# Altium project B100BA.PrjPcb (part 1 of 6)
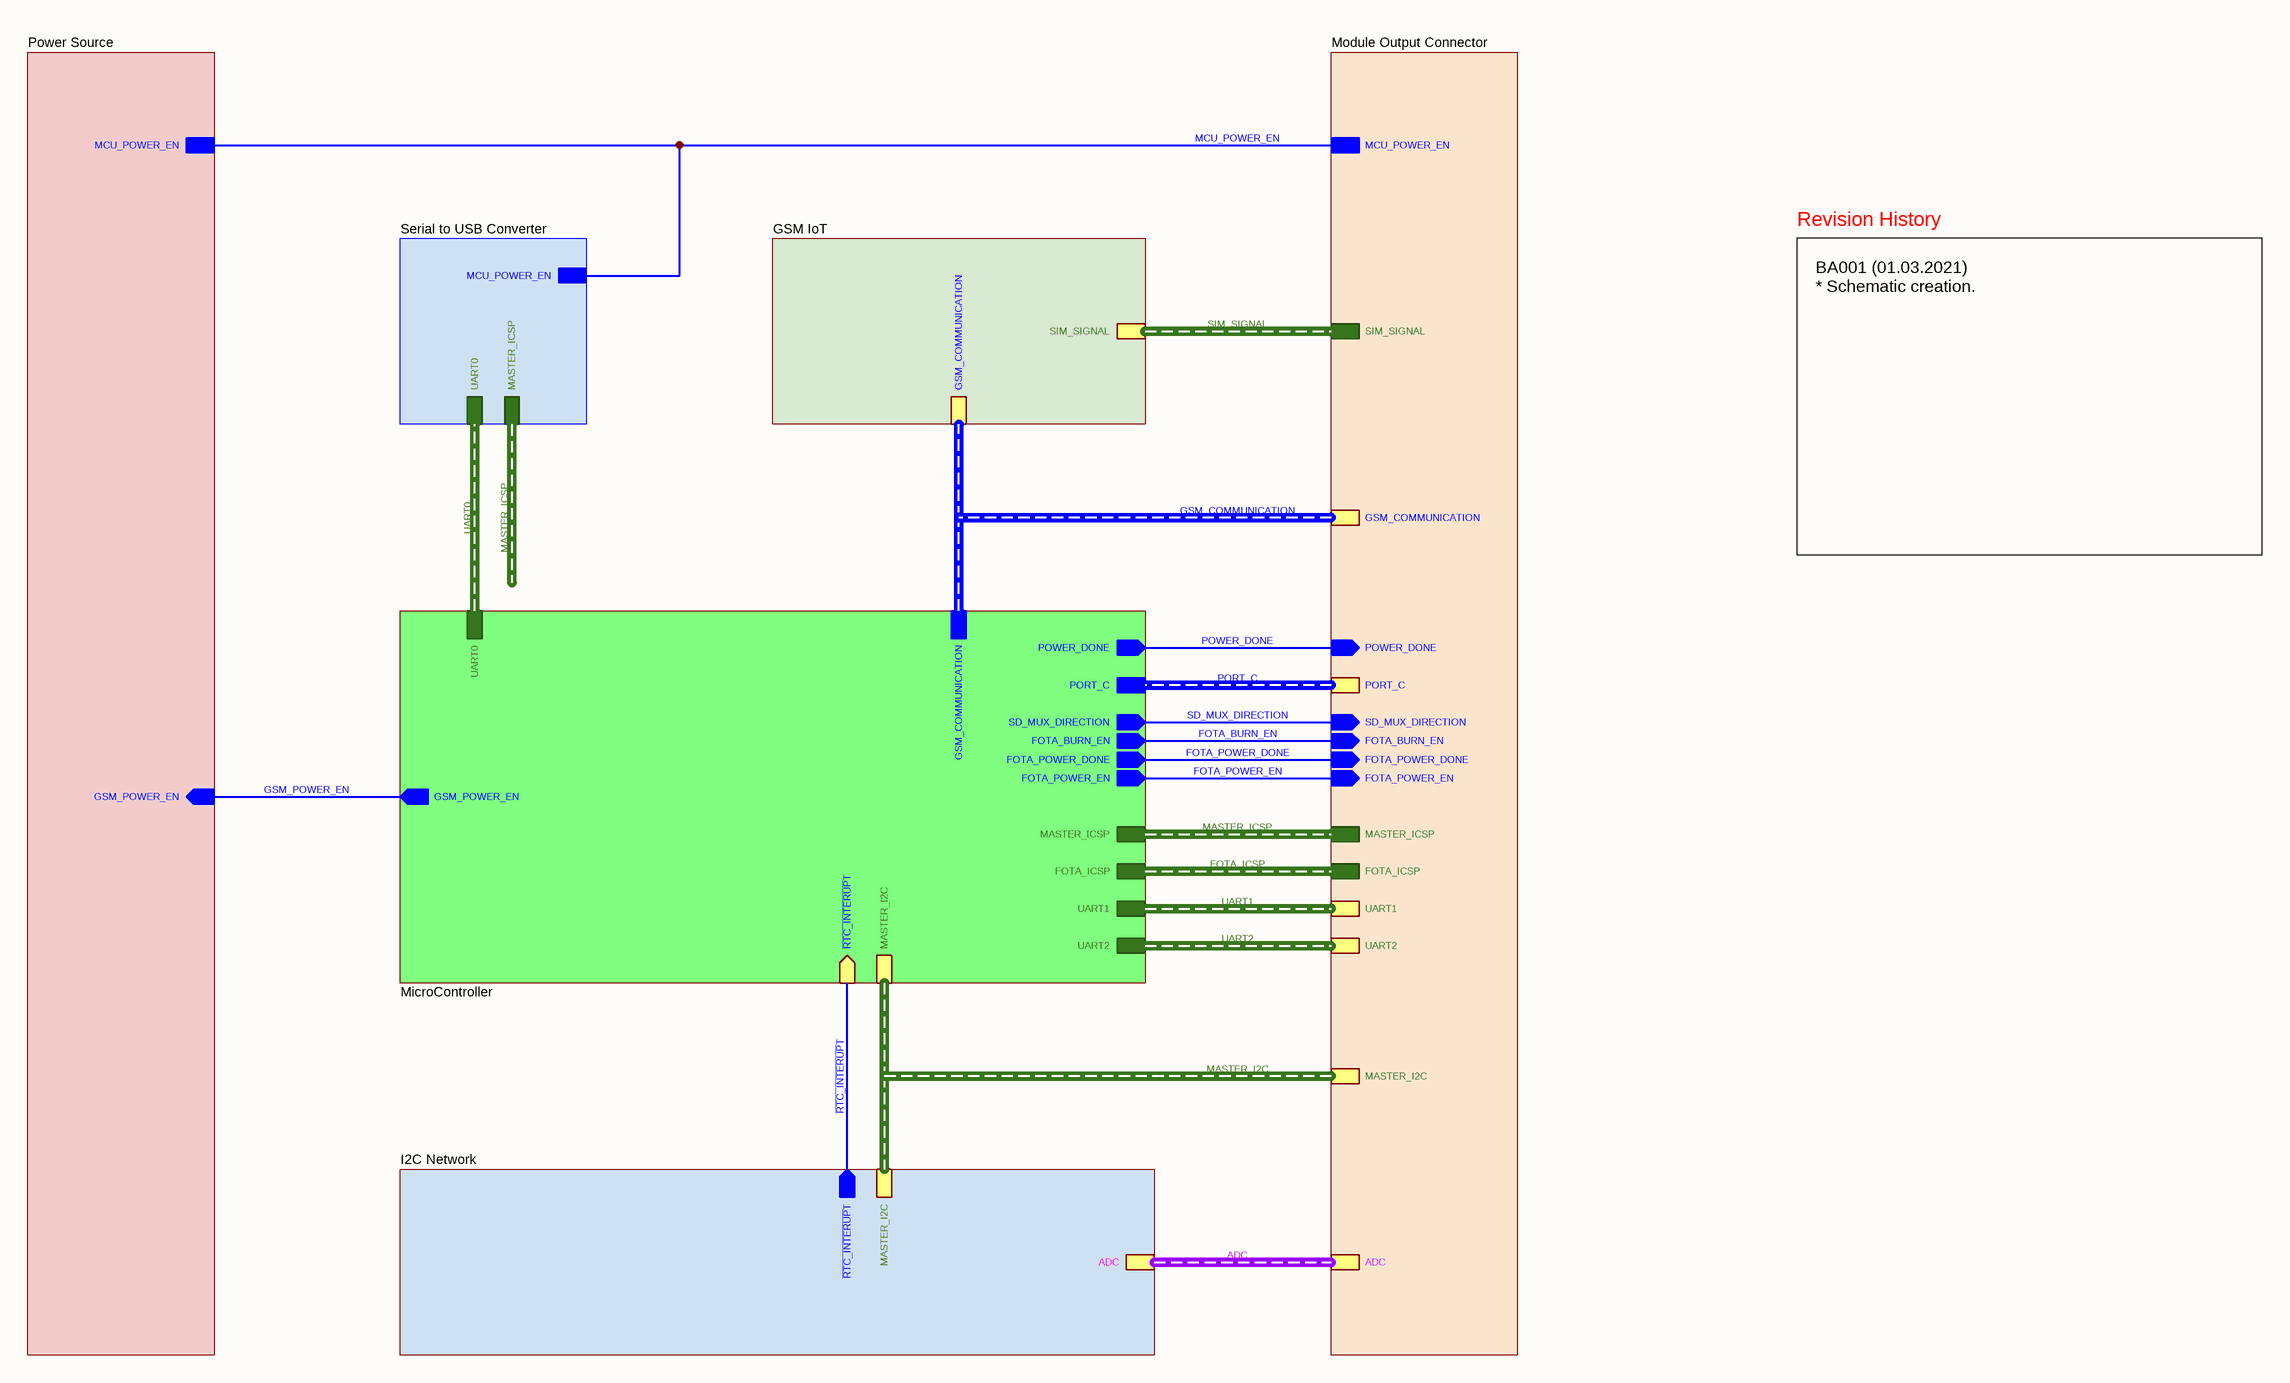
[diagram p0: B100 Block Diagram.SchDoc]
Address1_: Necip Fazıl Mah. Ortaırmak Sok.; Address2_: Birgül Apt. No: 19/6; Address3_: Meram / Konya; Address4_: Turkiye; Copyright_: © 2021 All rights reserved. [Commercial Secret]; Customer_: Ovoo Electronics; Engineer_: M. Günce Akkoyun; Git_Repo_Address_: https://www.github.com/akkoyun/B100; link_: http://www.ovoo.me; Module_ID_: B100; Organization_: Ovoo Electronics; Phone_: +90 506 7444300; Product_Desc_: GSM Iot Based Plug&Play SOM; Product_ID_: B100BA; Revision_: R01; Version_: BA
44 sheets, 277 parts. Net scope: hierarchical (ports join the sheet entries above them; power ports are global).
Sheets:
  B100 Block Diagram.SchDoc
    Power Source = Power Source.SchDoc
      3V8 Buck Boost Converter = 3V8 Buck Boost Converter.SchDoc
      5V Buck Boost Converter = 5V Buck Boost Converter.SchDoc
      Main Power Switch = Main Power Switch.SchDoc
      3V3 LDO Regulator = 3V3 LDO Regulator.SchDoc
    GSM IoT = GSM IoT Block Diagram.SchDoc
      GSM IoT Modem Core = GSM Modem Core.SchDoc
      GSM IoT eSIM = GSM eSIM.SchDoc
      GSM IoT Antenna = GSM Modem Antenna.SchDoc
      GSM IoT On/Off Control = GSM On-Off Control.SchDoc
      GSM IoT SDown Control = GSM SDown Control.SchDoc
      GSM Communication Voltage Translator = Bidirectional Voltage Translator.SchDoc
      GSM IoT LED Inducators = GSM LED Driver.SchDoc
    MicroController = MicroController.SchDoc
      Master MicroController = Master MicroController.SchDoc
        PORT L = Master MicroController Port L.SchDoc
        PORT K = Master MicroController Port K.SchDoc
        PORT F = Master MicroController Port F.SchDoc
        PORT D = Master MicroController Port D.SchDoc
        PORT C = Master MicroController Port C.SchDoc
        PORT B = Master MicroController Port B.SchDoc
        PORT A = Master MicroController Port A.SchDoc
        Master MicroController Core = Master MicroController Core.SchDoc
        PORT E = Master MicroController Port E.SchDoc
        PORT G = Master MicroController Port G.SchDoc
        PORT H = Master MicroController Port H.SchDoc
        PORT J = Master MicroController Port J.SchDoc
      SD Card and Select Switch = SD Card.SchDoc
      Piezzo Buzzer & Audio Amplifier = Buzzer.SchDoc
      LED Inducators = Master MicroController LED.SchDoc
      FOTA MicroController = FOTA MicroController Block Diagram.SchDoc
        FOTA MicroController Core = FOTA MicroController Core.SchDoc
        FOTA LED Driver = FOTA LED Driver.SchDoc
      FOTA Power Switch = FOTA MicroController Power Switch.SchDoc
      FOTA Burn Buffer = FOTA Burn Buffer.SchDoc
    I2C Network = I2C Network.SchDoc
      I2C Multiplexer = I2C Multiplexer.SchDoc
      I2C Real Time Clock = Real Time Clock.SchDoc
      I2C Serial ID EEprom = Serial ID EEPROM.SchDoc
      I2C EEprom = EEPROM.SchDoc
      I2C Analog Digital Converter = Analog Digital Converter.SchDoc
    Module Output Connector = Module Output Connector.SchDoc
    Serial to USB Converter = Serial to USB Converter.SchDoc

## Sheet B100 Block Diagram.SchDoc: B100 Block Diagram
size 393 x 281 mm; ApprovedBy: M. Günce Akkoyun; CheckedBy: M. Günce Akkoyun; Author: M. Günce Akkoyun; CompanyName: Ovoo Electronics; DrawnBy: M. Günce Akkoyun; Engineer: M. Günce Akkoyun; Organization: Ovoo Electronics; Address1: Necip Fazıl Mah. Ortaırmak Sok.; Address2: Birgül Apt. No: 19/6; Address3: Meram / Konya; Address4: Turkiye; DocumentNumber: 1; Revision: R01; SheetNumber: 1; SheetTotal: 44

### Sub-sheets
GSM IoT = GSM IoT Block Diagram.SchDoc: SIM_SIGNAL (harness SIM_SIGNAL), GSM_COMMUNICATION (harness GSM_COMMUNICATION)
I2C Network = I2C Network.SchDoc: MASTER_I2C (harness MASTER_I2C), ~{RTC_INTERUP}T (out), ADC (harness ADC)
MicroController = MicroController.SchDoc: MASTER_I2C (harness MASTER_I2C), ~{RTC_INTERUP}T (in), UART1 (harness UART1), UART2 (harness UART2), POWER_DONE (out), GSM_COMMUNICATION (harness GSM_COMMUNICATION), PORT_C (harness PORT_C), GSM_POWER_EN (out), UART0 (harness UART0), MASTER_ICSP (harness MASTER_ICSP), FOTA_ICSP (harness FOTA_ICSP), SD_MUX_DIRECTION (out), FOTA_BURN_EN (out), FOTA_POWER_DONE (out), FOTA_POWER_EN (out)
Module Output Connector = Module Output Connector.SchDoc: FOTA_ICSP (harness FOTA_ICSP), SIM_SIGNAL (harness SIM_SIGNAL), UART2 (harness UART2), GSM_COMMUNICATION (harness GSM_COMMUNICATION), ADC (harness ADC), MASTER_ICSP (harness MASTER_ICSP), MASTER_I2C (harness MASTER_I2C), UART1 (harness UART1), MCU_POWER_EN, PORT_C (harness PORT_C), POWER_DONE (in), SD_MUX_DIRECTION (in), FOTA_BURN_EN (in), FOTA_POWER_EN (in), FOTA_POWER_DONE (in)
Power Source = Power Source.SchDoc: GSM_POWER_EN (in), MCU_POWER_EN
Serial to USB Converter = Serial to USB Converter.SchDoc: UART0 (harness UART0), MASTER_ICSP (harness MASTER_ICSP), MCU_POWER_EN

### Nets
~{RTC_INTERUP}T: sheet MicroController/~{RTC_INTERUP}T, sheet I2C Network/~{RTC_INTERUP}T
FOTA_BURN_EN: sheet MicroController/FOTA_BURN_EN, sheet Module Output Connector/FOTA_BURN_EN
FOTA_POWER_DONE: sheet MicroController/FOTA_POWER_DONE, sheet Module Output Connector/FOTA_POWER_DONE
FOTA_POWER_EN: sheet MicroController/FOTA_POWER_EN, sheet Module Output Connector/FOTA_POWER_EN
GSM_POWER_EN: sheet Power Source/GSM_POWER_EN, sheet MicroController/GSM_POWER_EN
MCU_POWER_EN: sheet Power Source/MCU_POWER_EN, sheet Module Output Connector/MCU_POWER_EN, sheet Serial to USB Converter/MCU_POWER_EN
POWER_DONE: sheet MicroController/POWER_DONE, sheet Module Output Connector/POWER_DONE
SD_MUX_DIRECTION: sheet MicroController/SD_MUX_DIRECTION, sheet Module Output Connector/SD_MUX_DIRECTION

### Buses and harness runs
harness ADC = sheet I2C Network/ADC = sheet Module Output Connector/ADC
harness FOTA_ICSP = sheet MicroController/FOTA_ICSP = sheet Module Output Connector/FOTA_ICSP
harness GSM_COMMUNICATION = sheet GSM IoT/GSM_COMMUNICATION = sheet MicroController/GSM_COMMUNICATION = sheet Module Output Connector/GSM_COMMUNICATION
harness MASTER_I2C = sheet I2C Network/MASTER_I2C = sheet MicroController/MASTER_I2C = sheet Module Output Connector/MASTER_I2C
harness MASTER_ICSP = sheet MicroController/MASTER_ICSP = sheet Module Output Connector/MASTER_ICSP
harness MASTER_ICSP = sheet Serial to USB Converter/MASTER_ICSP
harness PORT_C = sheet MicroController/PORT_C = sheet Module Output Connector/PORT_C
harness SIM_SIGNAL = sheet GSM IoT/SIM_SIGNAL = sheet Module Output Connector/SIM_SIGNAL
harness UART0 = sheet MicroController/UART0 = sheet Serial to USB Converter/UART0
harness UART1 = sheet MicroController/UART1 = sheet Module Output Connector/UART1
harness UART2 = sheet MicroController/UART2 = sheet Module Output Connector/UART2

### Notes on the sheet
- Revision History
- BA001 (01.03.2021)
  * Schematic creation.
- © 2021 All rights reserved.
  This document may not, in whole or in part, be copied, photocopied, reproduced, translated or converted to any electronic or machine readable from without prior written permission of Mehmet Günce Akkoyun.
  Engineer contact : akkoyun@me.com
- Property of
- Engineer :
- Date :
- Size :
- A3
- Time :
- Project :
- Page :
- /
- Customer :
- Product ID :
- Module ID :
- Version :
- File :
- Revision :

## Sheet Power Source.SchDoc: Power Architechture Block Diagram
size 292 x 193 mm; ApprovedBy: M. Günce Akkoyun; CheckedBy: M. Günce Akkoyun; Author: M. Günce Akkoyun; CompanyName: Ovoo Electronics; DrawnBy: M. Günce Akkoyun; Engineer: M. Günce Akkoyun; Organization: Ovoo Electronics; Address1: Necip Fazıl Mah. Ortaırmak Sok.; Address2: Birgül Apt. No: 19/6; Address3: Meram / Konya; Address4: Turkiye; DocumentNumber: 2; Revision: R01; SheetNumber: 2; SheetTotal: 44
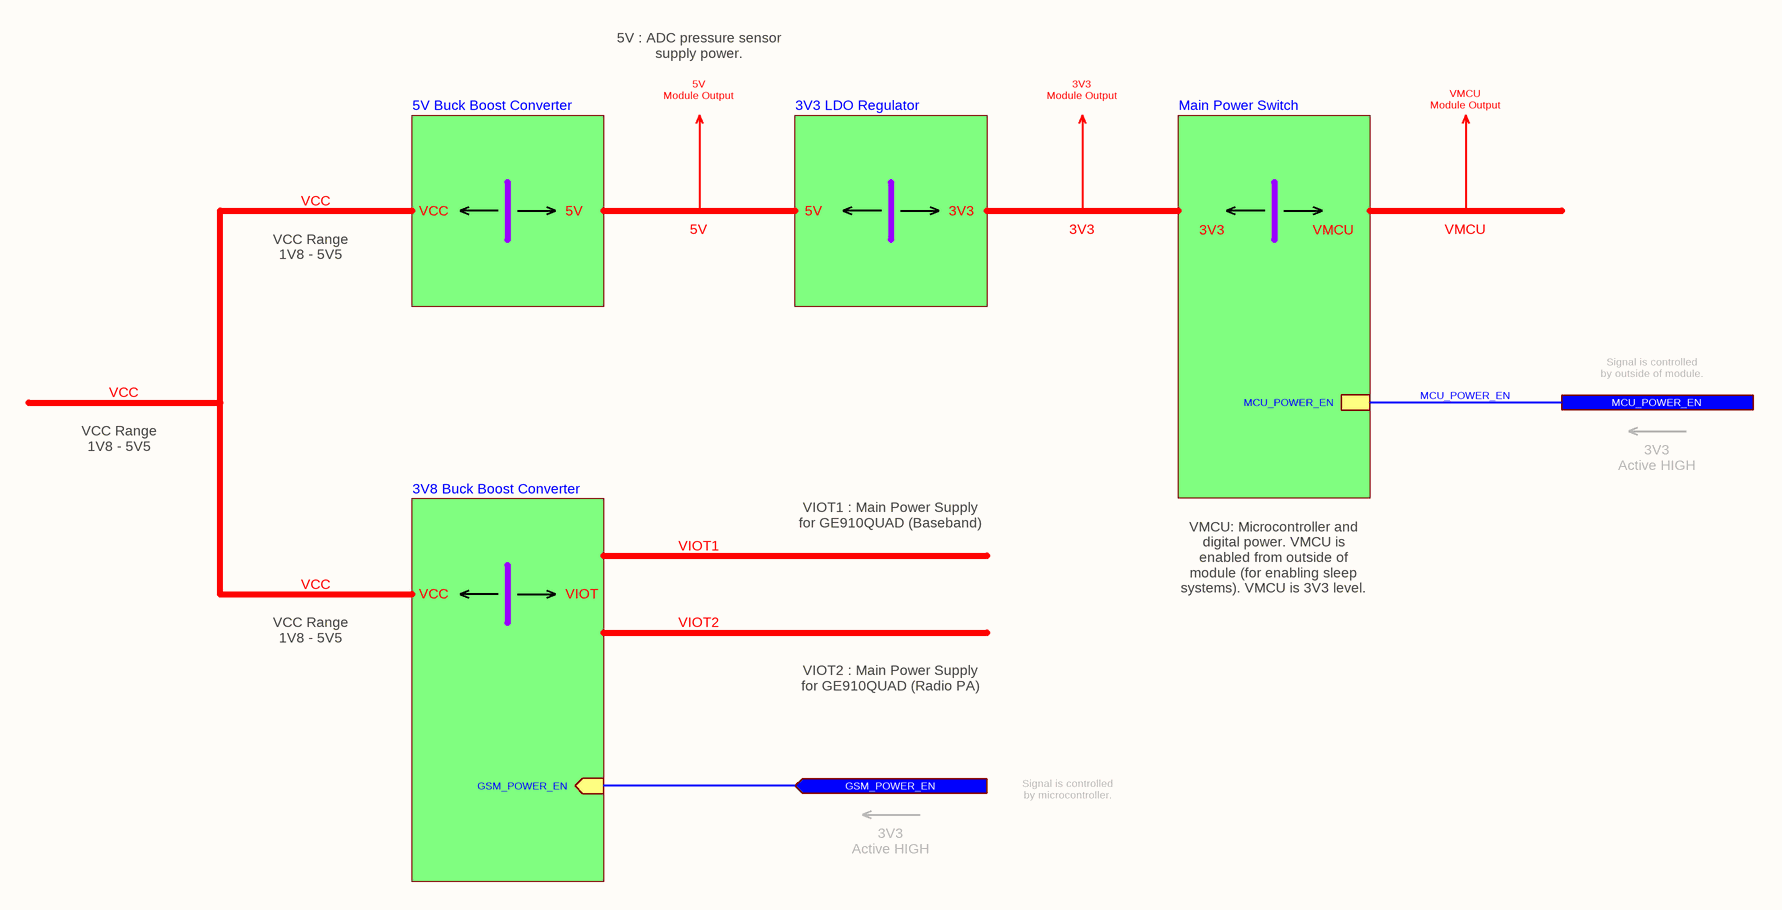
[diagram p1: Power Source.SchDoc]

### Sub-sheets
3V3 LDO Regulator = 3V3 LDO Regulator.SchDoc: no entries
3V8 Buck Boost Converter = 3V8 Buck Boost Converter.SchDoc: GSM_POWER_EN (in)
5V Buck Boost Converter = 5V Buck Boost Converter.SchDoc: no entries
Main Power Switch = Main Power Switch.SchDoc: MCU_POWER_EN

### Ports
GSM_POWER_EN (in), MCU_POWER_EN

### Nets
GSM_POWER_EN: port GSM_POWER_EN, sheet 3V8 Buck Boost Converter/GSM_POWER_EN
MCU_POWER_EN: port MCU_POWER_EN, sheet Main Power Switch/MCU_POWER_EN

### Notes on the sheet
- 5V : ADC pressure sensor supply power.
- 5V
  Module Output
- 3V3
  Module Output
- VMCU
  Module Output
- VCC
- 5V
- 3V3
- VMCU
- VCC Range
  1V8 - 5V5
- Signal is controlled by outside of module.
- 3V3
  Active HIGH
- VIOT
- VIOT2
- VIOT1
- VIOT1 : Main Power Supply for GE910QUAD (Baseband)
- VMCU: Microcontroller and digital power. VMCU is enabled from outside of module (for enabling sleep systems). VMCU is 3V3 level.
- VIOT2 : Main Power Supply for GE910QUAD (Radio PA)
- Signal is controlled by microcontroller.
- © 2021 All rights reserved.
  This document may not, in whole or in part, be copied, photocopied, reproduced, translated or converted to any electronic or machine readable from without prior written permission of Mehmet Günce Akkoyun.
  Engineer contact : akkoyun@me.com
- Property of
- Engineer :
- Date :
- Size :
- A4
- Time :
- Project :
- Page :
- /
- Customer :
- Product ID :
- Module ID :
- Version :
- File :
- Revision :

## Sheet 3V8 Buck Boost Converter.SchDoc: 3V8 DC/DC Buck Boost Converter and Power Filter
size 393 x 281 mm; ApprovedBy: M. Günce Akkoyun; CheckedBy: M. Günce Akkoyun; Author: M. Günce Akkoyun; CompanyName: Ovoo Electronics; DrawnBy: M. Günce Akkoyun; Engineer: M. Günce Akkoyun; Organization: Ovoo Electronics; Address1: Necip Fazıl Mah. Ortaırmak Sok.; Address2: Birgül Apt. No: 19/6; Address3: Meram / Konya; Address4: Turkiye; DocumentNumber: 3; Revision: R01; SheetNumber: 6; SheetTotal: 43
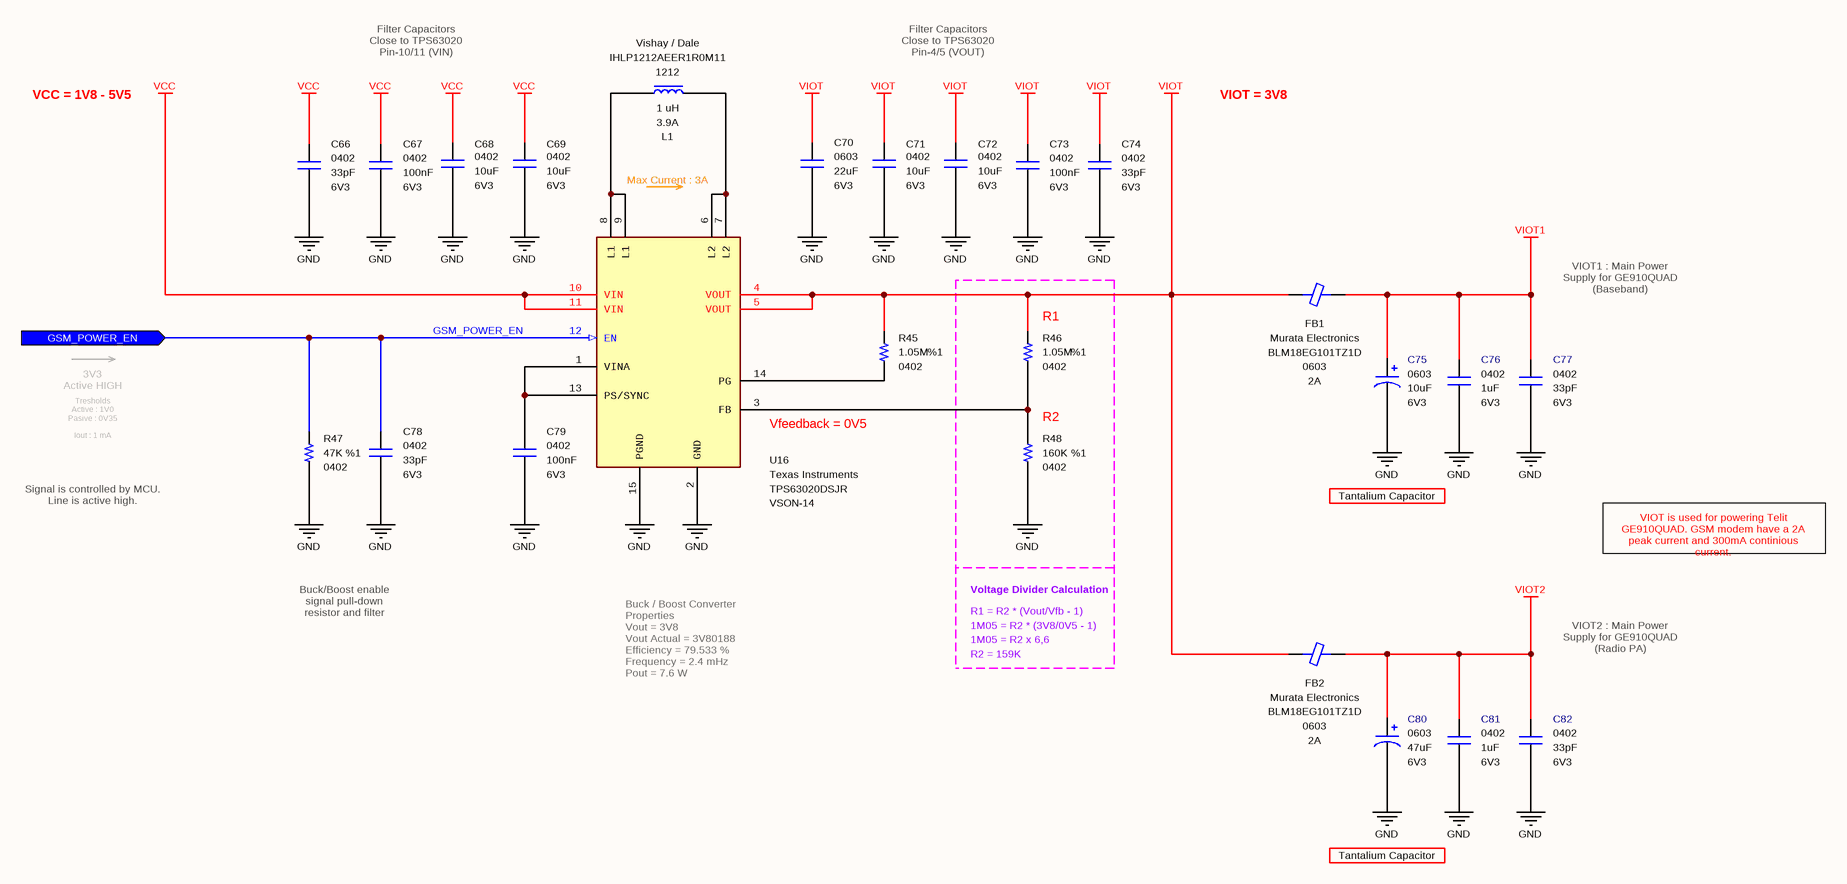
[diagram p2: 3V8 Buck Boost Converter.SchDoc]

### Parts
C66  value 33pF  Case: 0402  Voltage: 6V3  [CAPACITOR_0402]  (hidden comment: Multilayer Ceramic Capacitor)
C67  value 100nF  Case: 0402  Voltage: 6V3  [CAPACITOR_0402]  (hidden comment: Multilayer Ceramic Capacitor)
C68  value 10uF  Case: 0402  Voltage: 6V3  [CAPACITOR_0402]  (hidden comment: Multilayer Ceramic Capacitor)
C69  value 10uF  Case: 0402  Voltage: 6V3  [CAPACITOR_0402]  (hidden comment: Multilayer Ceramic Capacitor)
C70  value 22uF  Case: 0603  Voltage: 6V3  [CAPACITOR_0603]  (hidden comment: Multilayer Ceramic Capacitors)
C71  value 10uF  Case: 0402  Voltage: 6V3  [CAPACITOR_0402]  (hidden comment: Multilayer Ceramic Capacitor)
C72  value 10uF  Case: 0402  Voltage: 6V3  [CAPACITOR_0402]  (hidden comment: Multilayer Ceramic Capacitor)
C73  value 100nF  Case: 0402  Voltage: 6V3  [CAPACITOR_0402]  (hidden comment: Multilayer Ceramic Capacitor)
C74  value 33pF  Case: 0402  Voltage: 6V3  [CAPACITOR_0402]  (hidden comment: Multilayer Ceramic Capacitor)
C75  value 10uF  Case: 0603  Voltage: 6V3  [CAPACITOR_0603 - TANTALUM]  (hidden comment: Tantalum Capacitor)
C76  value 1uF  Case: 0402  Voltage: 6V3  [CAPACITOR_0402]  (hidden comment: Multilayer Ceramic Capacitor)
C77  value 33pF  Case: 0402  Voltage: 6V3  [CAPACITOR_0402]  (hidden comment: Multilayer Ceramic Capacitor)
C78  value 33pF  Case: 0402  Voltage: 6V3  [CAPACITOR_0402]  (hidden comment: Multilayer Ceramic Capacitor)
C79  value 100nF  Case: 0402  Voltage: 6V3  [CAPACITOR_0402]  (hidden comment: Multilayer Ceramic Capacitor)
C80  value 47uF  Case: 0603  Voltage: 6V3  [CAPACITOR_0603 - TANTALUM]  (hidden comment: Tantalum Capacitor)
C81  value 1uF  Case: 0402  Voltage: 6V3  [CAPACITOR_0402]  (hidden comment: Multilayer Ceramic Capacitor)
C82  value 33pF  Case: 0402  Voltage: 6V3  [CAPACITOR_0402]  (hidden comment: Multilayer Ceramic Capacitor)
FB1  value BLM18EG101TZ1D  Case: 0603  Maximum DC Current: 2A  Manufacturer Name: Murata Electronics  [INDUCATOR_0603]  (hidden comment: Ferrite Bead)
FB2  value BLM18EG101TZ1D  Case: 0603  Maximum DC Current: 2A  Manufacturer Name: Murata Electronics  [INDUCATOR_0603]  (hidden comment: Ferrite Bead)
L1  value 1 uH  Maximum DC Current: 3.9A  Case: 1212  Manufacturer Part Number: IHLP1212AEER1R0M11  Manufacturer Name: Vishay / Dale  [IHLP-1212]  (hidden comment: Vishay - IHLP1212AEER1R0M11)
R45  value 1.05M  Tolerance: %1  Case: 0402  [RESISTOR_0402]  (hidden comment: Thick Film Resistor)
R46  value 1.05M  Tolerance: %1  Case: 0402  [RESISTOR_0402]  (hidden comment: Thick Film Resistor)
R47  value 47K  Tolerance: %1  Case: 0402  [RESISTOR_0402]  (hidden comment: 47K - 0402 - %1 - 1/16W)
R48  value 160K  Tolerance: %1  Case: 0402  [RESISTOR_0402]  (hidden comment: Thick Film Resistor)
U16  Manufacturer Part Number: TPS63020DSJR  Manufacturer Name: Texas Instruments  [VSON-14]  (hidden comment: Texas Instruments - TPS63020DSJR)

### Ports
GSM_POWER_EN (in)

### Nets
GND: C66.1 C67.2 C68.1 C69.1 C70.1 C71.1 C72.1 C73.2 C74.1 C75.2 C76.1 C77.1 C78.1 C79.2 C80.2 C81.1 C82.1 R47.1 R48.1 U16.2(GND) U16.15(PGND)
VCC: C66.2 C67.1 C68.2 C69.2 U16.10(VIN) U16.11(VIN)
VIOT: C70.2 C71.2 C72.2 C73.1 C74.2 FB1.1 FB2.1 R45.2 R46.2 U16.4(VOUT) U16.5(VOUT)
VIOT1: C75.1 C76.2 C77.2 FB1.2
VIOT2: C80.1 C81.2 C82.2 FB2.2
GSM_POWER_EN: C78.2 R47.2 U16.12(EN) ; port GSM_POWER_EN
NetC79_1: C79.1 U16.1(VINA) U16.13(PS/SYNC)
NetL1_1: L1.1 U16.8(L1) U16.9(L1)
NetL1_2: L1.2 U16.6(L2) U16.7(L2)
NetR45_1: R45.1 U16.14(PG)
NetR46_1: R46.1 R48.2 U16.3(FB)

### Notes on the sheet
- VCC = 1V8 - 5V5
- Filter Capacitors
  Close to TPS63020
  Pin-10/11 (VIN)
- Filter Capacitors
  Close to TPS63020
  Pin-4/5 (VOUT)
- VIOT = 3V8
- (near R46) R1
- VIOT1 : Main Power Supply for GE910QUAD (Baseband)
- 3V3
  Active HIGH
- (near R48) R2
- Tresholds
  Active : 1V0
  Pasive : 0V35
  Iout : 1 mA
- (near U16) Vfeedback = 0V5
- Signal is controlled by MCU. Line is active high.
- Tantalium Capacitor
- VIOT is used for powering Telit GE910QUAD. GSM modem have a 2A peak current and 300mA continious current.
- Buck/Boost enable signal pull-down resistor and filter capacitor.
- 1M05 = R2 * (3V8/0V5 - 1)
- R1 = R2 * (Vout/Vfb - 1)
- Voltage Divider Calculation
- Buck / Boost Converter Properties
  Vout = 3V8
  Vout Actual = 3V80188
  Efficiency = 79.533 %
  Frequency = 2.4 mHz
  Pout = 7.6 W
- 1M05 = R2 x 6,6
- R2 = 159K
- VIOT2 : Main Power Supply for GE910QUAD (Radio PA)
- © 2021 All rights reserved.
  This document may not, in whole or in part, be copied, photocopied, reproduced, translated or converted to any electronic or machine readable from without prior written permission of Mehmet Günce Akkoyun.
  Engineer contact : akkoyun@me.com
- Property of
- Engineer :
- Date :
- Size :
- A3
- Time :
- Project :
- Page :
- /
- Customer :
- Product ID :
- Module ID :
- Version :
- File :
- Revision :
- (in symbol IC - TPS63020DSJR) Max Current : 3A

### Library data of the parts
C66 C74 C77 C78 C82 = Capacitor - 33pF [0402-6V3]: Capacitor - 33pF [0402] (Ceramic); Manufacturer Name: Kemet; Manufacturer Part Number: C0402C330J9RACAUTO; Dielectric: X7R; Tolerance: 10%; Height: 0.5mm; Maximum Operating Temperature: +125; Minimum Operating Temperature: -55; ROHS: Yes; ComponentLink1Description: DataSheet; ComponentLink1URL: https://api.kemet.com/component-edge/download/datasheet/C0402C330J9RACAUTO.pdf; ComponentLink2Description: Mouser; ComponentLink2URL: https://www.mouser.com/Search/Refine.aspx?Keyword=80-C0402C330J9RAUTO; Supplier 1: Mouser; Supplier Part Number 1: 80-C0402C330J9RAUTO; Mouser Part Number: 80-C0402C330J9RAUTO
C67 C73 C79 = Capacitor - 100nF [0402-6V3]: Capacitor - 100nF [0402-6V3] (Ceramic); Manufacturer Name: AVX; Manufacturer Part Number: 04026D104KAT4A; Dielectric: X5R; Tolerance: %10; Height: 0.25mm; ComponentLink1Description: Mouser; ComponentLink1URL: https://www.mouser.com.tr/ProductDetail/AVX/04026D104KAT4A?qs=sGAEpiMZZMs0AnBnWHyRQPg4iYkCw7IMED%2F4kpqgf7w%3D; ComponentLink2Description: DataSheet; ComponentLink2URL: https://www.mouser.com.tr/datasheet/2/40/cx5r-776519.pdf; ROHS: Yes; Maximum Operating Temperature: +85; Minimum Operating Temperature: -55; Supplier 1: Avnet; Supplier Part Number 1: 04026D104KAT4A; Mouser Part Number: 581-04026D104KAT4A
C68 C69 C71 C72 = Capacitor - 10uF [0402-6V3]: Capacitor - 10uF [0402] (Ceramic); Manufacturer Name: Kemet; Manufacturer Part Number: C0402C106M9PACTU; Dielectric: X5R; Tolerance: 20%; Height: 0.5mm; Mouser Part Number: 80-C0402C106M9P; Maximum Operating Temperature: +85; Minimum Operating Temperature: -55; RoHS: Yes; ComponentLink1Description: DataSheet; ComponentLink1URL: https://www.mouser.com.tr/datasheet/2/212/KEM_C1006_X5R_SMD-1103249.pdf; ComponentLink2Description: Mouser; ComponentLink2URL: https://www.mouser.com.tr/ProductDetail/KEMET/C0402C106M9PACTU?qs=sGAEpiMZZMs0AnBnWHyRQE3yiXa%2FuseC7%252BLTT67ezUCLPvFYe0E%252BJg%3D%3D; Supplier 1: Avnet; Supplier 2: Mouser; Supplier 3: Arrow; Supplier 4: Farnell; Supplier 5: Newark; Supplier 6: Farnell; Supplier 7: Digi-Key; Supplier 8: Newark; Supplier Part Number 1: C0402C106M9PACTU; Supplier Part Number 2: 80-C0402C106M9P; Supplier Part Number 3: C0402C106M9PACTU; Supplier Part Number 4: 2507061; Supplier Part Number 5: 75Y0593; Supplier Part Number 6: 2750752; Supplier Part Number 7: 399-13069-1-ND; Supplier Part Number 8: 29AC4166
C70 = Capacitor - 22uF [0603-6V3]: Capacitor - 22uF [0603] (Ceramic); Manufacturer Name: Murata; Manufacturer Part Number: GRM188R60J226MEA0D; Dielectric: X5R; Tolerance: %20; Height: 0.8mm; ComponentLink2Description: DataSheet; ComponentLink2URL: https://eu.mouser.com/datasheet/2/281/murata_03052018_GRM_Series_1-1310166.pdf; ROHS: Yes; Maximum Operating Temperature: +85; Minimum Operating Temperature: -55; Supplier 1: Newark; Supplier 2: Future Electronics; Supplier 3: Newark; Supplier 4: Avnet; Supplier 5: Avnet; Supplier 6: Digi-Key; Supplier 7: Mouser; Supplier 8: Digi-Key; Supplier 9: RSComponents; Supplier 10: Digi-Key; Supplier 11: Future Electronics; Supplier 12: Arrow Electronics; Supplier 13: Farnell; Supplier 14: Farnell; Supplier 15: Farnell; Supplier 16: Future Electronics; Supplier 17: Future Electronics; Supplier 18: RSComponents; Supplier 19: RSComponents; Supplier Part Number 1: 55Y9854; Supplier Part Number 2: 7104049; Supplier Part Number 3: 03AC2653; Supplier Part Number 4: 55Y9854; Supplier Part Number 5: GRM188R60J226MEA0D; Supplier Part Number 6: 490-7611-1-ND; Supplier Part Number 7: 81-GRM188R60J226ME0D; Supplier Part Number 8: 490-7611-6-ND; Supplier Part Number 9: 8847251; Supplier Part Number 10: 490-7611-2-ND; Supplier Part Number 12: GRM188R60J226MEA0D; Supplier Part Number 13: 2494232; Supplier Part Number 14: 2494232RL; Supplier Part Number 15: 2666490; Supplier Part Number 11: 2030727; Supplier Part Number 16: GRM188R60J226MEA0D-CUTT; Supplier Part Number 17: GRM188R60J226MEA0D-REEL; Supplier Part Number 18: 1449045; Supplier Part Number 19: 8847251P
C75 = Capacitor - 10uF [0603-6V3] (Tantalium): Capacitor - 10uF [0603] (Tantalium); Manufacturer Name: AVX; Manufacturer Part Number: F380J106MMAAH3; ESR: 200 mOhms; Leakage Current: 10uA; Tolerance: 20%; Height: 0.8mm; Maximum Operating Temperature: +105; Minimum Operating Temperature: -55; ROHS: Yes; ComponentLink1Description: DataSheet; ComponentLink1URL: https://www.mouser.com.tr/datasheet/2/40/f38-775706.pdf; ComponentLink2Description: Mouser; ComponentLink2URL: https://www.mouser.com.tr/ProductDetail/AVX/F380J106MMAAH3?qs=sGAEpiMZZMtZ1n0r9vR22fixilZl6Mr8zRKleESmvcDFwZ4LSyC6Pg%3D%3D; Supplier 1: Mouser; Supplier 2: Digi-Key; Supplier Part Number 2: 478-12031-1-ND; Supplier Part Number 1: 581-F380J106MMAAH3; Mouser Part Number: 581-F380J106MMAAH3
C76 C81 = Capacitor - 1uF [0402-6V3]: Capacitor - 1uF [0402] (Ceramic); Manufacturer Name: Murata Electronics; Manufacturer Part Number: GRM153R60J105ME95D; Dielectric: X5R; Tolerance: 20%; Height: 0.3mm; Maximum Operating Temperature: +85; Minimum Operating Temperature: -55; RoHS: Yes; Weight: 6mg; ComponentLink1Description: DataSheet; ComponentLink1URL: https://psearch.en.murata.com/capacitor/product/GRM153R60J105ME95%23.html; ComponentLink2Description: Mouser; ComponentLink2URL: https://www.mouser.com/Search/Refine.aspx?Keyword=81-GRM153R60J105ME5D; Supplier 1: Future Electronics; Supplier 2: Future Electronics; Supplier 3: Mouser; Supplier 4: Arrow; Supplier 5: Digi-Key; Supplier Part Number 5: 490-14576-1-ND; Supplier Part Number 4: GRM153R60J105ME95D; Supplier Part Number 3: 81-GRM153R60J105ME5D; Supplier Part Number 2: GRM153R60J105ME95D-REEL; Supplier Part Number 1: GRM153R60J105ME95D-CUTT; Mouser Part Number: 81-GRM153R60J105ME5D
C80 = Capacitor - 47u [0603-6V3] (Tantalium): Capacitor - 47uF [0603] (Tantalium); Manufacturer Name: AVX; Manufacturer Part Number: F380J476MMAAXEH3; ESR: 300 mOhms; Leakage Current: 59.2uA; Tolerance: 20%; Height: 0.8 mm; Maximum Operating Temperature: +105; Minimum Operating Temperature: -55; ROHS: Yes; Weight: 2mg; ComponentLink1Description: DataSheet; ComponentLink1URL: https://www.mouser.com.tr/datasheet/2/40/f38-775706.pdf; ComponentLink2Description: Mouser; ComponentLink2URL: https://www.mouser.com.tr/ProductDetail/AVX/F380J476MMAAXEH3?qs=sGAEpiMZZMtZ1n0r9vR22RxGXmrWTp1dAwL15%252BtiGosce1Uk5KTrYw%3D%3D; Supplier 1: Avnet; Supplier Part Number 1: F380J476MMAAXEH3; Mouser Part Number: 581-F380J476MMAAXEH3
FB1 FB2 = Ferrite Bead - 2A [0603]: Ferrite Beads 0603 100ohms 2000mA Auto Infotainment; Tolerance: 25%; Maximum DC Resistance: 45 mOhms; Height: 0.75mm; ROHS: Yes; Minimum Operating Temperature: -55; Maximum Operating Temperature: +125; Impedance: 100 Ohms; ComponentLink1Description: DataSheet; ComponentLink1URL: http://www.murata.com/~/media/webrenewal/support/library/catalog/products/emc/emifil/c31e.ashx?la=en-gb; ComponentLink2Description: Mouser; ComponentLink2URL: https://www.mouser.com/Search/Refine.aspx?Keyword=81-BLM18EG101TZ1D; Supplier 1: Mouser; Supplier Part Number 1: 81-BLM18EG101TZ1D; Manufacturer Part Number: BLM18EG101TZ1D; Mouser Part Number: 81-BLM18EG101TZ1D; Mouser Price/Stock: https://www.mouser.com/Search/Refine.aspx?Keyword=81-BLM18EG101TZ1D
L1 = Inductor - 1 uH [1212]: Fixed Inductors 1uH 20%; Maximum DC Resistance: 33 mOhms; Height: 1.2mm; ComponentLink1Description: DataSheet; ComponentLink1URL: https://www.mouser.com.tr/datasheet/2/445/7443551130-1721712.pdf; ComponentLink2Description: Mouser; ComponentLink2URL: https://www.mouser.com.tr/ProductDetail/Wurth-Elektronik/7443551130?qs=%2Fha2pyFaduhqRAqaB9EFxxGemvWRqW7raK8BZ9C7YF%252B79iYidgbP5A%3D%3D; Maximum Operating Temperature: +125; Minimum Operating Temperature: -55; Tolerance: 20%; Supplier 1: Digi-Key; Supplier 2: Digi-Key; Supplier 3: Digi-Key; Supplier 4: Newark; Supplier 5: Newark; Supplier 6: Avnet; Supplier 7: Arrow Electronics; Supplier 8: Mouser; Supplier 9: Newark; Supplier 10: Future Electronics; Supplier 11: Future Electronics; Supplier 12: Farnell; Supplier 13: Farnell; Supplier 14: Farnell; Supplier 15: Avnet; Supplier 16: Future Electronics; Supplier 17: Future Electronics; Supplier 18: Newark; Supplier Part Number 1: 541-1327-1-ND; Supplier Part Number 2: 541-1327-6-ND; Supplier Part Number 3: 541-1327-2-ND; Supplier Part Number 4: 27T2308; Supplier Part Number 5: 38AH0532; Supplier Part Number 6: IHLP1212AEER1R0M11; Supplier Part Number 7: IHLP1212AEER1R0M11; Supplier Part Number 8: 70-IHLP1212AEER1R0M1; Supplier Part Number 18: 64T3094; Supplier Part Number 17: IHLP1212AEER1R0M11-REEL; Supplier Part Number 16: IHLP1212AEER1R0M11-CUTT; Supplier Part Number 15: 27T2308; Supplier Part Number 14: 2056526RL; Supplier Part Number 12: 2392942; Supplier Part Number 11: 5038784; Supplier Part Number 10: 8098630; Supplier Part Number 13: 2056526; Supplier Part Number 9: 24T8255
R45 R46 = Resistor - 1.05M: Thick Film Resistors - SMD 1/16 W 1.05 Mohms 1%; Manufacturer Name: Vishay; Manufacturer Part Number: CRCW04021M05FKED; Height: 0.35mm; Mouser Part Number: 71-CRCW04021M05FKED; ComponentLink1Description: DataSheet; ComponentLink1URL: https://www.mouser.com.tr/datasheet/2/427/dcrcwe3-1762152.pdf; ComponentLink2Description: Mouser; ComponentLink2URL: https://www.mouser.com.tr/ProductDetail/Vishay-Dale/CRCW04021M05FKED?qs=sGAEpiMZZMu61qfTUdNhGwALI1ohWcNjjLjJuYicL5s%3D; Supplier 1: Mouser; Supplier 2: Digi-Key; Supplier Part Number 1: 71-CRCW04021M05FKED; Supplier Part Number 2: 541-1.05MLCT-ND
R47 = Resistor - 47K: Thick Film Resistors - SMD 1/16 W 47 Kohms 1%; Manufacturer Name: Vishay; Manufacturer Part Number: CRCW040247K0FKED; Height: 0.4mm; ComponentLink1Description: DataSheet; ComponentLink1URL: https://www.mouser.com.tr/datasheet/2/427/dcrcwe3-1762152.pdf; ComponentLink2Description: Mouser; ComponentLink2URL: https://www.mouser.com.tr/ProductDetail/Vishay-Dale/CRCW040247K0FKED?qs=sGAEpiMZZMu61qfTUdNhG2DpbjADlD3GL%252B3h1elTxqU%3D; Supplier 1: RSComponents; Supplier 2: Newark; Supplier Part Number 1: 6789361P; Supplier Part Number 2: 52K7097; Supplier 3: Avnet; Supplier 4: RSComponents; Supplier 5: Future Electronics; Supplier 6: Future Electronics; Supplier 7: Newark; Supplier 8: Arrow Electronics; Supplier 9: Mouser; Supplier 10: Newark; Supplier 11: Avnet; Supplier 12: Digi-Key; Supplier 13: Digi-Key; Supplier 14: Digi-Key; Supplier 15: Newark; Supplier 16: Farnell; Supplier 17: Farnell; Supplier 18: Farnell; Supplier 19: Allied Electronics; Supplier 20: Allied Electronics; Supplier 21: Avnet; Supplier 22: Future Electronics; Supplier 23: Future Electronics; Supplier 24: Future Electronics; Supplier 25: Newark; Supplier 26: RSComponents; Supplier 27: RSComponents; Supplier Part Number 3: 52K7097; Supplier Part Number 4: 6789361; Supplier Part Number 5: 2103738; Supplier Part Number 6: 7521222; Supplier Part Number 7: 42K3500; Supplier Part Number 8: CRCW040247K0FKED; Supplier Part Number 12: 541-47.0KLCT-ND; Supplier Part Number 14: 541-47.0KLTR-ND; Supplier Part Number 10: 61M5310; Supplier Part Number 9: 71-CRCW0402-47K-E3; Supplier Part Number 13: 541-47.0KLDKR-ND; Supplier Part Number 11: CRCW040247K0FKED; Supplier Part Number 15: 25AC7165; Supplier Part Number 16: 1469719; Supplier Part Number 18: 2121814; Supplier Part Number 17: 1469719RL; Supplier Part Number 19: 70202660; Supplier Part Number 20: 70272767; Supplier Part Number 21: 42K3500; Supplier Part Number 22: 6128776; Supplier Part Number 24: CRCW040247K0FKED-REEL; Supplier Part Number 23: CRCW040247K0FKED-CUTT; Supplier Part Number 25: 24W2315; Supplier Part Number 26: 1688455; Supplier Part Number 27: 1823505
R48 = Resistor - 160K: Thick Film Resistors - SMD 1/16 W 159 Kohms 1%; Manufacturer Name: Vishay; Manufacturer Part Number: CRCW0402160KFKED; Height: 0.35mm; ComponentLink1Description: DataSheet; ComponentLink1URL: https://www.mouser.com.tr/datasheet/2/427/dcrcwe3-1762152.pdf; ComponentLink2Description: Mouser; ComponentLink2URL: https://www.mouser.com.tr/ProductDetail/Vishay-Dale/CRCW0402150KFKED?qs=sGAEpiMZZMu61qfTUdNhG2DpbjADlD3G9hjnBJFk8Z8%3D; Supplier 1: Digi-Key; Supplier 2: Digi-Key; Supplier 3: Avnet; Supplier 4: Newark; Supplier 5: RSComponents; Supplier 6: Newark; Supplier 7: Mouser; Supplier 8: Farnell; Supplier 9: Farnell; Supplier Part Number 1: 541-160KLCT-ND; Supplier Part Number 2: 541-160KLDKR-ND; Supplier Part Number 3: CRCW0402160KFKED; Supplier Part Number 4: 26W8999; Supplier Part Number 5: 6788804; Supplier Part Number 6: 89M6611; Supplier Part Number 7: 71-CRCW0402160KFKED; Supplier Part Number 8: 2140947; Supplier Part Number 9: 2317176
U16 = IC - TPS63020DSJR: Switching Voltage Regulators 93% Eff Buck-Boost Converter; Height: 1mm; ComponentLink1Description: DataSheet; ComponentLink1URL: http://www.ti.com/general/docs/suppproductinfo.tsp?distId=26&gotoUrl=http%3A%2F%2Fwww.ti.com%2Flit%2Fgpn%2Ftps63020; ROHS: Yes; Minimum Operating Temperature: -40 C; Maximum Operating Temperature: +85 C; ComponentLink2Description: Product Page; ComponentLink2URL: https://www.ti.com/product/TPS63020; Supplier 1: Digi-Key; Supplier 2: Digi-Key; Supplier 3: Digi-Key; Supplier 4: Mouser; Supplier 5: Arrow Electronics; Supplier 6: Newark; Supplier 7: Bison Technologies; Supplier 8: Bison Technologies; Supplier 9: Farnell; Supplier 10: Farnell; Supplier 11: Farnell; Supplier 12: Farnell; Supplier 13: Avnet; Supplier 14: Digi-Key; Supplier 15: Farnell; Supplier 16: Newark; Supplier 17: Newark; Supplier 18: Newark; Supplier Part Number 1: 296-36491-1-ND; Supplier Part Number 2: 296-36491-6-ND; Supplier Part Number 3: 296-36491-2-ND; Supplier Part Number 4: 595-TPS63020DSJR; Supplier Part Number 5: TPS63020DSJR; Supplier Part Number 6: 28AH6014; Supplier Part Number 7: TPS63020DSJR-211084-TI; Supplier Part Number 8: TPS63020DSJR-95326-TEXAS INSTRUMENTS; Supplier Part Number 9: 3007457; Supplier Part Number 10: 2781753; Supplier Part Number 11: 2781753RL; Supplier Part Number 12: 3007457RL; Supplier Part Number 13: TPS63020DSJR; Supplier Part Number 14: TPS63020DSJR-ND; Supplier Part Number 15: 2542792; Supplier Part Number 16: 44AC7695; Supplier Part Number 17: 74R6637; Supplier Part Number 18: 81Y9813; Case: VSON-14

## Sheet 5V Buck Boost Converter.SchDoc: 5V DC/DC Buck Boost Converter
size 292 x 193 mm; ApprovedBy: M. Günce Akkoyun; CheckedBy: M. Günce Akkoyun; Author: M. Günce Akkoyun; CompanyName: Ovoo Electronics; DrawnBy: M. Günce Akkoyun; Engineer: M. Günce Akkoyun; Organization: Ovoo Electronics; Address1: Necip Fazıl Mah. Ortaırmak Sok.; Address2: Birgül Apt. No: 19/6; Address3: Meram / Konya; Address4: Turkiye; DocumentNumber: 7; Revision: R01; SheetNumber: 3; SheetTotal: 42
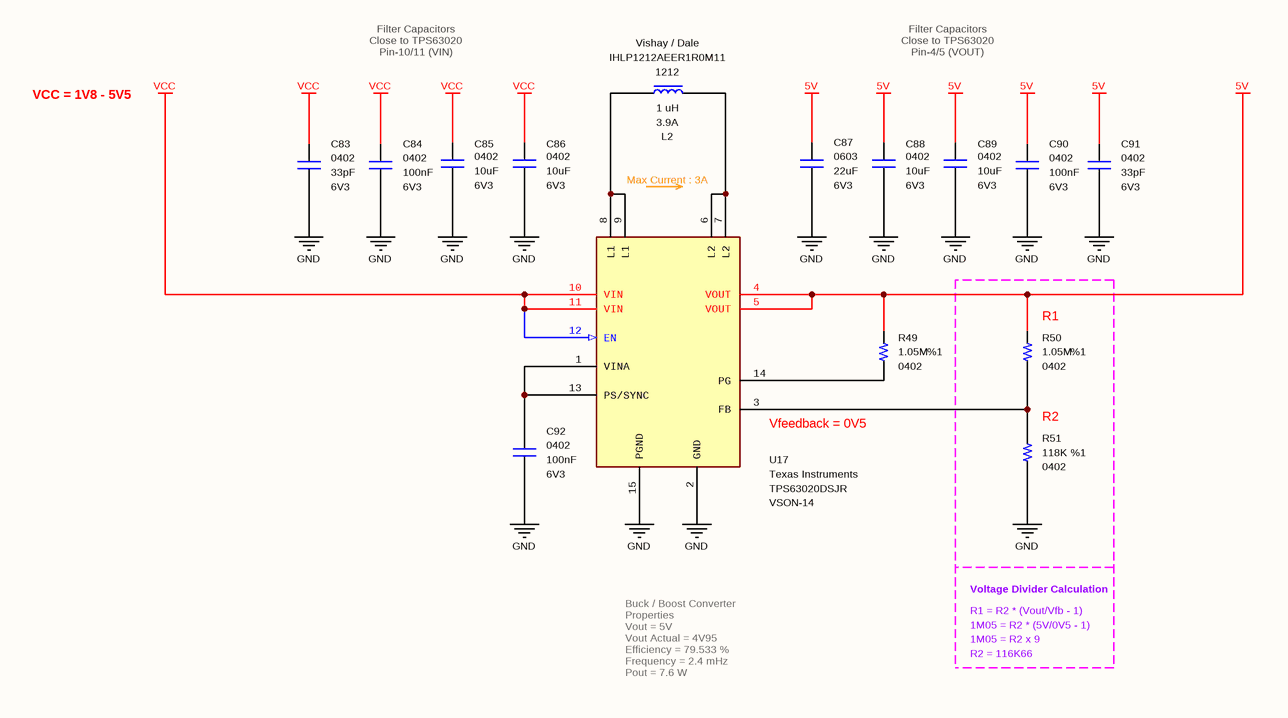
[diagram p3: 5V Buck Boost Converter.SchDoc]

### Parts
C83  value 33pF  Case: 0402  Voltage: 6V3  [CAPACITOR_0402]  (hidden comment: Multilayer Ceramic Capacitor)
C84  value 100nF  Case: 0402  Voltage: 6V3  [CAPACITOR_0402]  (hidden comment: Multilayer Ceramic Capacitor)
C85  value 10uF  Case: 0402  Voltage: 6V3  [CAPACITOR_0402]  (hidden comment: Multilayer Ceramic Capacitor)
C86  value 10uF  Case: 0402  Voltage: 6V3  [CAPACITOR_0402]  (hidden comment: Multilayer Ceramic Capacitor)
C87  value 22uF  Case: 0603  Voltage: 6V3  [CAPACITOR_0603]  (hidden comment: Multilayer Ceramic Capacitors)
C88  value 10uF  Case: 0402  Voltage: 6V3  [CAPACITOR_0402]  (hidden comment: Multilayer Ceramic Capacitor)
C89  value 10uF  Case: 0402  Voltage: 6V3  [CAPACITOR_0402]  (hidden comment: Multilayer Ceramic Capacitor)
C90  value 100nF  Case: 0402  Voltage: 6V3  [CAPACITOR_0402]  (hidden comment: Multilayer Ceramic Capacitor)
C91  value 33pF  Case: 0402  Voltage: 6V3  [CAPACITOR_0402]  (hidden comment: Multilayer Ceramic Capacitor)
C92  value 100nF  Case: 0402  Voltage: 6V3  [CAPACITOR_0402]  (hidden comment: Multilayer Ceramic Capacitor)
L2  value 1 uH  Maximum DC Current: 3.9A  Case: 1212  Manufacturer Part Number: IHLP1212AEER1R0M11  Manufacturer Name: Vishay / Dale  [IHLP-1212]  (hidden comment: Vishay - IHLP1212AEER1R0M11)
R49  value 1.05M  Tolerance: %1  Case: 0402  [RESISTOR_0402]  (hidden comment: Thick Film Resistor)
R50  value 1.05M  Tolerance: %1  Case: 0402  [RESISTOR_0402]  (hidden comment: Thick Film Resistor)
R51  value 118K  Tolerance: %1  Case: 0402  [RESISTOR_0402]  (hidden comment: Thick Film Resistor)
U17  Manufacturer Part Number: TPS63020DSJR  Manufacturer Name: Texas Instruments  [VSON-14]  (hidden comment: Texas Instruments - TPS63020DSJR)

### Nets
5V: C87.2 C88.2 C89.2 C90.1 C91.2 R49.2 R50.2 U17.4(VOUT) U17.5(VOUT)
GND: C83.1 C84.2 C85.1 C86.1 C87.1 C88.1 C89.1 C90.2 C91.1 C92.2 R51.1 U17.2(GND) U17.15(PGND)
VCC: C83.2 C84.1 C85.2 C86.2 U17.10(VIN) U17.11(VIN) U17.12(EN)
NetC92_1: C92.1 U17.1(VINA) U17.13(PS/SYNC)
NetL2_1: L2.1 U17.8(L1) U17.9(L1)
NetL2_2: L2.2 U17.6(L2) U17.7(L2)
NetR49_1: R49.1 U17.14(PG)
NetR50_1: R50.1 R51.2 U17.3(FB)

### Notes on the sheet
- Filter Capacitors
  Close to TPS63020
  Pin-10/11 (VIN)
- Filter Capacitors
  Close to TPS63020
  Pin-4/5 (VOUT)
- VCC = 1V8 - 5V5
- (near R50) R1
- (near U17) Vfeedback = 0V5
- (near R51) R2
- 1M05 = R2 * (5V/0V5 - 1)
- R1 = R2 * (Vout/Vfb - 1)
- Voltage Divider Calculation
- Buck / Boost Converter Properties
  Vout = 5V
  Vout Actual = 4V95
  Efficiency = 79.533 %
  Frequency = 2.4 mHz
  Pout = 7.6 W
- 1M05 = R2 x 9
- R2 = 116K66
- © 2021 All rights reserved.
  This document may not, in whole or in part, be copied, photocopied, reproduced, translated or converted to any electronic or machine readable from without prior written permission of Mehmet Günce Akkoyun.
  Engineer contact : akkoyun@me.com
- Property of
- Engineer :
- Date :
- Size :
- A4
- Time :
- Project :
- Page :
- /
- Customer :
- Product ID :
- Module ID :
- Version :
- File :
- Revision :
- (in symbol IC - TPS63020DSJR) Max Current : 3A

### Library data of the parts
C83 C91 = Capacitor - 33pF [0402-6V3]: as C66 on sheet 3V8 Buck Boost Converter; Height: 0.5mm; Maximum Operating Temperature: +125; Minimum Operating Temperature: -55; ROHS: Yes; ComponentLink1Description: DataSheet; ComponentLink1URL: https://api.kemet.com/component-edge/download/datasheet/C0402C330J9RACAUTO.pdf; ComponentLink2Description: Mouser; ComponentLink2URL: https://www.mouser.com/Search/Refine.aspx?Keyword=80-C0402C330J9RAUTO; Supplier 1: Mouser; Supplier Part Number 1: 80-C0402C330J9RAUTO; Mouser Part Number: 80-C0402C330J9RAUTO
C84 C90 C92 = Capacitor - 100nF [0402-6V3]: as C67 on sheet 3V8 Buck Boost Converter; Height: 0.25mm; ComponentLink1Description: Mouser; ComponentLink1URL: https://www.mouser.com.tr/ProductDetail/AVX/04026D104KAT4A?qs=sGAEpiMZZMs0AnBnWHyRQPg4iYkCw7IMED%2F4kpqgf7w%3D; ComponentLink2Description: DataSheet; ComponentLink2URL: https://www.mouser.com.tr/datasheet/2/40/cx5r-776519.pdf; ROHS: Yes; Maximum Operating Temperature: +85; Minimum Operating Temperature: -55; Supplier 1: Avnet; Supplier Part Number 1: 04026D104KAT4A; Mouser Part Number: 581-04026D104KAT4A
C85 C86 C88 C89 = Capacitor - 10uF [0402-6V3]: as C68 on sheet 3V8 Buck Boost Converter; Height: 0.5mm; Mouser Part Number: 80-C0402C106M9P; Maximum Operating Temperature: +85; Minimum Operating Temperature: -55; RoHS: Yes; ComponentLink1Description: DataSheet; ComponentLink1URL: https://www.mouser.com.tr/datasheet/2/212/KEM_C1006_X5R_SMD-1103249.pdf; ComponentLink2Description: Mouser; ComponentLink2URL: https://www.mouser.com.tr/ProductDetail/KEMET/C0402C106M9PACTU?qs=sGAEpiMZZMs0AnBnWHyRQE3yiXa%2FuseC7%252BLTT67ezUCLPvFYe0E%252BJg%3D%3D; Supplier 1: Avnet; Supplier 2: Mouser; Supplier 3: Arrow; Supplier 4: Farnell; Supplier 5: Newark; Supplier 6: Farnell; Supplier 7: Digi-Key; Supplier 8: Newark; Supplier Part Number 1: C0402C106M9PACTU; Supplier Part Number 2: 80-C0402C106M9P; Supplier Part Number 3: C0402C106M9PACTU; Supplier Part Number 4: 2507061; Supplier Part Number 5: 75Y0593; Supplier Part Number 6: 2750752; Supplier Part Number 7: 399-13069-1-ND; Supplier Part Number 8: 29AC4166
C87 = Capacitor - 22uF [0603-6V3]: as C70 on sheet 3V8 Buck Boost Converter; Height: 0.8mm; ComponentLink2Description: DataSheet; ComponentLink2URL: https://eu.mouser.com/datasheet/2/281/murata_03052018_GRM_Series_1-1310166.pdf; ROHS: Yes; Maximum Operating Temperature: +85; Minimum Operating Temperature: -55; Supplier 1: Newark; Supplier 2: Future Electronics; Supplier 3: Newark; Supplier 4: Avnet; Supplier 5: Avnet; Supplier 6: Digi-Key; Supplier 7: Mouser; Supplier 8: Digi-Key; Supplier 9: RSComponents; Supplier 10: Digi-Key; Supplier 11: Future Electronics; Supplier 12: Arrow Electronics; Supplier 13: Farnell; Supplier 14: Farnell; Supplier 15: Farnell; Supplier 16: Future Electronics; Supplier 17: Future Electronics; Supplier 18: RSComponents; Supplier 19: RSComponents; Supplier Part Number 1: 55Y9854; Supplier Part Number 2: 7104049; Supplier Part Number 3: 03AC2653; Supplier Part Number 4: 55Y9854; Supplier Part Number 5: GRM188R60J226MEA0D; Supplier Part Number 6: 490-7611-1-ND; Supplier Part Number 7: 81-GRM188R60J226ME0D; Supplier Part Number 8: 490-7611-6-ND; Supplier Part Number 9: 8847251; Supplier Part Number 10: 490-7611-2-ND; Supplier Part Number 12: GRM188R60J226MEA0D; Supplier Part Number 13: 2494232; Supplier Part Number 14: 2494232RL; Supplier Part Number 15: 2666490; Supplier Part Number 11: 2030727; Supplier Part Number 16: GRM188R60J226MEA0D-CUTT; Supplier Part Number 17: GRM188R60J226MEA0D-REEL; Supplier Part Number 18: 1449045; Supplier Part Number 19: 8847251P
L2 = Inductor - 1 uH [1212]: as L1 on sheet 3V8 Buck Boost Converter; Height: 1.2mm; ComponentLink1Description: DataSheet; ComponentLink1URL: https://www.mouser.com.tr/datasheet/2/445/7443551130-1721712.pdf; ComponentLink2Description: Mouser; ComponentLink2URL: https://www.mouser.com.tr/ProductDetail/Wurth-Elektronik/7443551130?qs=%2Fha2pyFaduhqRAqaB9EFxxGemvWRqW7raK8BZ9C7YF%252B79iYidgbP5A%3D%3D; Maximum Operating Temperature: +125; Minimum Operating Temperature: -55; Tolerance: 20%; Supplier 1: Digi-Key; Supplier 2: Digi-Key; Supplier 3: Digi-Key; Supplier 4: Newark; Supplier 5: Newark; Supplier 6: Avnet; Supplier 7: Arrow Electronics; Supplier 8: Mouser; Supplier 9: Newark; Supplier 10: Future Electronics; Supplier 11: Future Electronics; Supplier 12: Farnell; Supplier 13: Farnell; Supplier 14: Farnell; Supplier 15: Avnet; Supplier 16: Future Electronics; Supplier 17: Future Electronics; Supplier 18: Newark; Supplier Part Number 1: 541-1327-1-ND; Supplier Part Number 2: 541-1327-6-ND; Supplier Part Number 3: 541-1327-2-ND; Supplier Part Number 4: 27T2308; Supplier Part Number 5: 38AH0532; Supplier Part Number 6: IHLP1212AEER1R0M11; Supplier Part Number 7: IHLP1212AEER1R0M11; Supplier Part Number 8: 70-IHLP1212AEER1R0M1; Supplier Part Number 18: 64T3094; Supplier Part Number 17: IHLP1212AEER1R0M11-REEL; Supplier Part Number 16: IHLP1212AEER1R0M11-CUTT; Supplier Part Number 15: 27T2308; Supplier Part Number 14: 2056526RL; Supplier Part Number 12: 2392942; Supplier Part Number 11: 5038784; Supplier Part Number 10: 8098630; Supplier Part Number 13: 2056526; Supplier Part Number 9: 24T8255
R49 R50 = Resistor - 1.05M: as R45 on sheet 3V8 Buck Boost Converter; Height: 0.35mm; Mouser Part Number: 71-CRCW04021M05FKED; ComponentLink1Description: DataSheet; ComponentLink1URL: https://www.mouser.com.tr/datasheet/2/427/dcrcwe3-1762152.pdf; ComponentLink2Description: Mouser; ComponentLink2URL: https://www.mouser.com.tr/ProductDetail/Vishay-Dale/CRCW04021M05FKED?qs=sGAEpiMZZMu61qfTUdNhGwALI1ohWcNjjLjJuYicL5s%3D; Supplier 1: Mouser; Supplier 2: Digi-Key; Supplier Part Number 1: 71-CRCW04021M05FKED; Supplier Part Number 2: 541-1.05MLCT-ND
R51 = Resistor - 10K [0402]: Thick Film Resistors - SMD 1/16 W 118 Kohms 1%; Manufacturer Name: Vishay; Manufacturer Part Number: CRCW0402118KFKED; Height: 0.35mm; ComponentLink1Description: DataSheet; ComponentLink1URL: https://www.mouser.com.tr/datasheet/2/427/dcrcwe3-1762152.pdf; ComponentLink2Description: Mouser; ComponentLink2URL: https://eu.mouser.com/ProductDetail/Vishay-Dale/CRCW0402127KFKED?qs=sGAEpiMZZMu61qfTUdNhG2DpbjADlD3G3QqPJgESRYg%3D; Supplier 1: Digi-Key; Supplier 2: Digi-Key; Supplier 3: Digi-Key; Supplier 4: Newark; Supplier 5: Avnet; Supplier 6: RSComponents; Supplier 7: RSComponents; Supplier 8: Arrow Electronics; Supplier 9: Mouser; Supplier Part Number 1: 541-118KLCT-ND; Supplier Part Number 2: 541-118KLDKR-ND; Supplier Part Number 3: 541-118KLTR-ND; Supplier Part Number 4: 52K6643; Supplier Part Number 5: 52K6643; Supplier Part Number 6: 6788728P; Supplier Part Number 7: 6788728; Supplier Part Number 8: CRCW0402118KFKED; Supplier Part Number 9: 71-CRCW0402-118K-E3
U17 = IC - TPS63020DSJR: as U16 on sheet 3V8 Buck Boost Converter; Height: 1mm; ComponentLink1Description: DataSheet; ComponentLink1URL: http://www.ti.com/general/docs/suppproductinfo.tsp?distId=26&gotoUrl=http%3A%2F%2Fwww.ti.com%2Flit%2Fgpn%2Ftps63020; ROHS: Yes; Minimum Operating Temperature: -40 C; Maximum Operating Temperature: +85 C; ComponentLink2Description: Product Page; ComponentLink2URL: https://www.ti.com/product/TPS63020; Supplier 1: Digi-Key; Supplier 2: Digi-Key; Supplier 3: Digi-Key; Supplier 4: Mouser; Supplier 5: Arrow Electronics; Supplier 6: Newark; Supplier 7: Bison Technologies; Supplier 8: Bison Technologies; Supplier 9: Farnell; Supplier 10: Farnell; Supplier 11: Farnell; Supplier 12: Farnell; Supplier 13: Avnet; Supplier 14: Digi-Key; Supplier 15: Farnell; Supplier 16: Newark; Supplier 17: Newark; Supplier 18: Newark; Supplier Part Number 1: 296-36491-1-ND; Supplier Part Number 2: 296-36491-6-ND; Supplier Part Number 3: 296-36491-2-ND; Supplier Part Number 4: 595-TPS63020DSJR; Supplier Part Number 5: TPS63020DSJR; Supplier Part Number 6: 28AH6014; Supplier Part Number 7: TPS63020DSJR-211084-TI; Supplier Part Number 8: TPS63020DSJR-95326-TEXAS INSTRUMENTS; Supplier Part Number 9: 3007457; Supplier Part Number 10: 2781753; Supplier Part Number 11: 2781753RL; Supplier Part Number 12: 3007457RL; Supplier Part Number 13: TPS63020DSJR; Supplier Part Number 14: TPS63020DSJR-ND; Supplier Part Number 15: 2542792; Supplier Part Number 16: 44AC7695; Supplier Part Number 17: 74R6637; Supplier Part Number 18: 81Y9813; Case: VSON-14